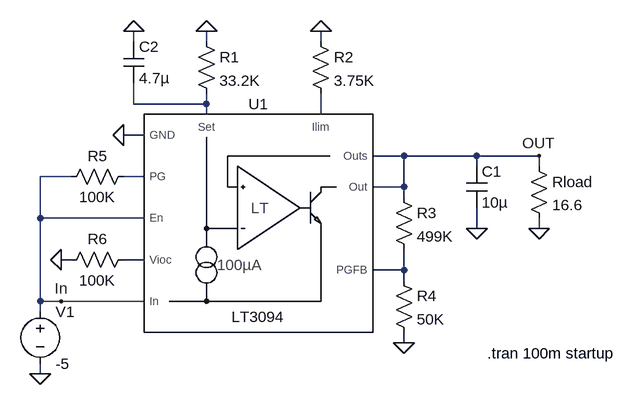
[diagram p0: schematic 3094.asc]
3094.asc, the LTspice schematic file:
Version 4
SHEET 1 1112 680
WIRE 64 -80 64 -96
WIRE 176 -80 176 -96
WIRE 352 -80 352 -96
WIRE 64 16 64 -16
WIRE 176 16 176 0
WIRE 176 16 64 16
WIRE 176 32 176 16
WIRE 352 32 352 0
WIRE 80 64 48 64
WIRE 480 96 432 96
WIRE 592 96 480 96
WIRE 688 96 592 96
WIRE 592 112 592 96
WIRE 688 112 688 96
WIRE -32 128 -80 128
WIRE 80 128 48 128
WIRE 480 144 480 96
WIRE 480 144 432 144
WIRE 480 160 480 144
WIRE -80 192 -80 128
WIRE 80 192 -80 192
WIRE 592 208 592 176
WIRE 688 208 688 192
WIRE -32 256 -48 256
WIRE 80 256 48 256
WIRE 480 272 480 240
WIRE 480 272 432 272
WIRE 480 288 480 272
WIRE -80 320 -80 192
WIRE -48 320 -80 320
WIRE 80 320 -48 320
WIRE -80 336 -80 320
WIRE 480 384 480 368
WIRE -80 432 -80 416
FLAG 480 384 0
FLAG -80 432 0
FLAG 48 64 0
FLAG 176 -96 0
FLAG 352 -96 0
FLAG 688 208 0
FLAG 592 208 0
FLAG 64 -96 0
FLAG -48 256 0
FLAG -48 320 In
FLAG 688 96 OUT
SYMBOL voltage -80 320 R0
WINDOW 123 0 0 Left 0
WINDOW 39 0 0 Left 0
SYMATTR InstName V1
SYMATTR Value -5
SYMBOL res 160 -96 R0
SYMATTR InstName R1
SYMATTR Value 33.2K
SYMBOL res 336 -96 R0
SYMATTR InstName R2
SYMATTR Value 3.75K
SYMBOL res 464 144 R0
SYMATTR InstName R3
SYMATTR Value 499K
SYMBOL res 464 272 R0
SYMATTR InstName R4
SYMATTR Value 50K
SYMBOL res 64 112 R90
WINDOW 0 0 56 VBottom 2
WINDOW 3 32 56 VTop 2
SYMATTR InstName R5
SYMATTR Value 100K
SYMBOL cap 576 112 R0
SYMATTR InstName C1
SYMATTR Value 10µ
SYMBOL cap 48 -80 R0
SYMATTR InstName C2
SYMATTR Value 4.7µ
SYMBOL res 64 240 R90
WINDOW 0 0 56 VBottom 2
WINDOW 3 32 56 VTop 2
SYMATTR InstName R6
SYMATTR Value 100K
SYMBOL LT3094 256 144 R0
SYMATTR InstName U1
SYMBOL res 672 96 R0
SYMATTR InstName Rload
SYMATTR Value 16.6
TEXT 608 400 Left 2 !.tran 100m startup

The netlist it stands for:
* 3094.asc
V1 In 0 -5
R1 0 N001 33.2K
R2 0 N002 3.75K
R3 OUT N005 499K
R4 N005 0 50K
R5 N003 In 100K
C1 OUT 0 10µ
C2 0 N001 4.7µ
R6 N004 0 100K
XU1 In In N003 N005 N002 N004 N001 0 OUT OUT LT3094  ; pins In En PG PGFB Ilim Vioc Set GND Outs Out
Rload OUT 0 16.6
.tran 100m startup
.lib LT3094.sub
.backanno
.end